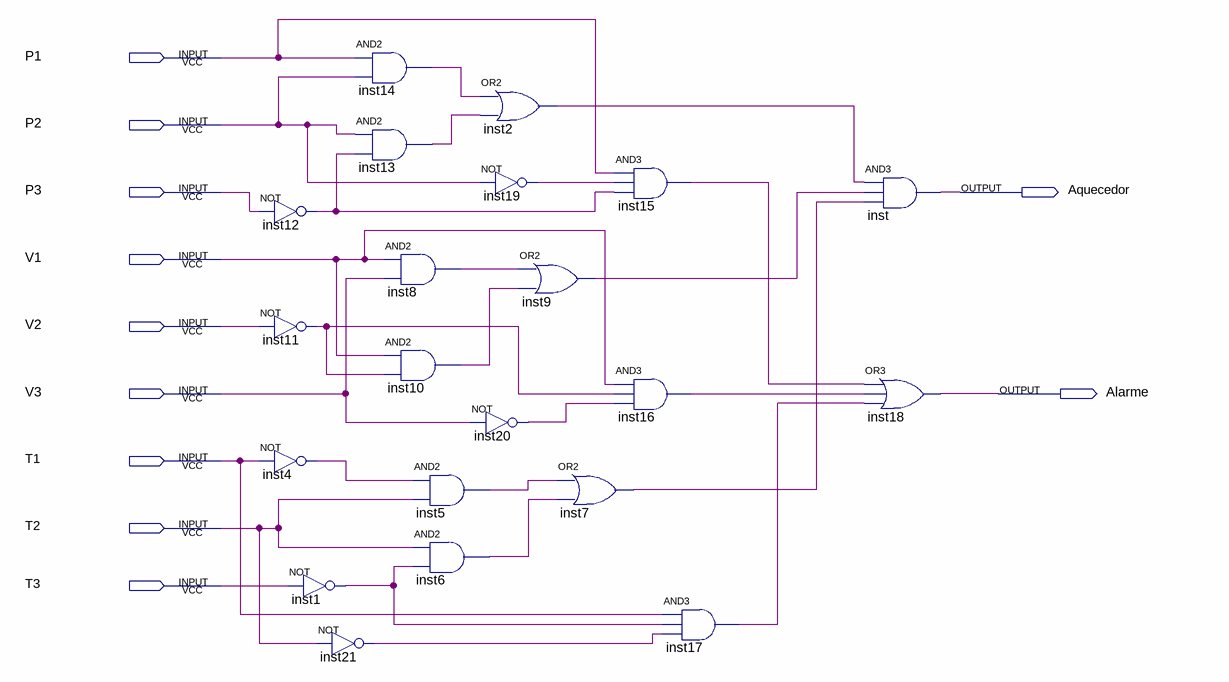
[diagram p0: schematic sheet]
// Quartus schematic Controlador_de_processo_fabril.bdf as structural Verilog: 21 symbols, 11 pins
module Controlador_de_processo_fabril (
  input  P1,
  input  P2,
  input  P3,
  input  V1,
  input  V2,
  input  V3,
  input  T1,
  input  T2,
  input  T3,
  output Aquecedor,
  output Alarme
);

  wire inst1_out, inst2_out, inst4_out, inst5_out, inst6_out, inst7_out, inst8_out, inst9_out, inst10_out,
       inst11_out, inst12_out, inst13_out, inst14_out, inst15_out, inst16_out, inst17_out, inst19_out,
       inst20_out, inst21_out;

  not inst12 (inst12_out, P3);
  not inst11 (inst11_out, V2);
  not inst4 (inst4_out, T1);
  not inst1 (inst1_out, T3);
  not inst21 (inst21_out, T2);
  and inst14 (inst14_out, P1, P2);
  and inst13 (inst13_out, P2, inst12_out);
  and inst8 (inst8_out, V1, V3);
  and inst10 (inst10_out, V1, inst11_out);
  not inst20 (inst20_out, V3);
  and inst5 (inst5_out, inst4_out, T2);
  and inst6 (inst6_out, T2, inst1_out);
  or inst2 (inst2_out, inst14_out, inst13_out);
  not inst19 (inst19_out, P2);
  or inst9 (inst9_out, inst8_out, inst10_out);
  and inst15 (inst15_out, P1, inst19_out, inst12_out);
  and inst16 (inst16_out, V1, inst11_out, inst20_out);
  or inst7 (inst7_out, inst5_out, inst6_out);
  and inst17 (inst17_out, T1, inst1_out, inst21_out);
  and inst (Aquecedor, inst2_out, inst9_out, inst7_out);
  or inst18 (Alarme, inst15_out, inst16_out, inst17_out);
endmodule
